# Altium schematic sheet 100nF 50V electro. SCH.schdoc
size 124 x 99 mm
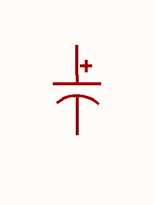
[diagram p0: 100nF 50V electro. SCH.schdoc]

## Parts
C?  100nF  [CAP-TH_BD5.0-P2.00-D0.8-FD]  (value not drawn)

## Nets

Not connected (* = marked no-connect by the designer): C? 1 2

## Library data of the parts
C? = KM104M050D11RR0VH2FP0: Manufacturer: CX(承兴); Symbol: 0.1UF 50V; Add into BOM: yes; Tolerance: ±20%; Lifetime @ Temp: 1000hrs@105℃; Device: KM104M050D11RR0VH2FP0; LCSC Part Name: 100nF ±20% 50V; Supplier Part: C28061; Manufacturer Part: KM104M050D11RR0VH2FP0; Supplier Footprint: 插件,D5xL11mm; JLCPCB Part Class: Extended Part; Datasheet: https://atta.szlcsc.com/upload/public/pdf/source/20211027/06D6BA3719C264B639DC286D935D03EA.pdf; Supplier: LCSC; Convert to PCB: yes; Value: 100nF